# Altium project EB2_Cyclone_BGA324 1_03.PrjPCB
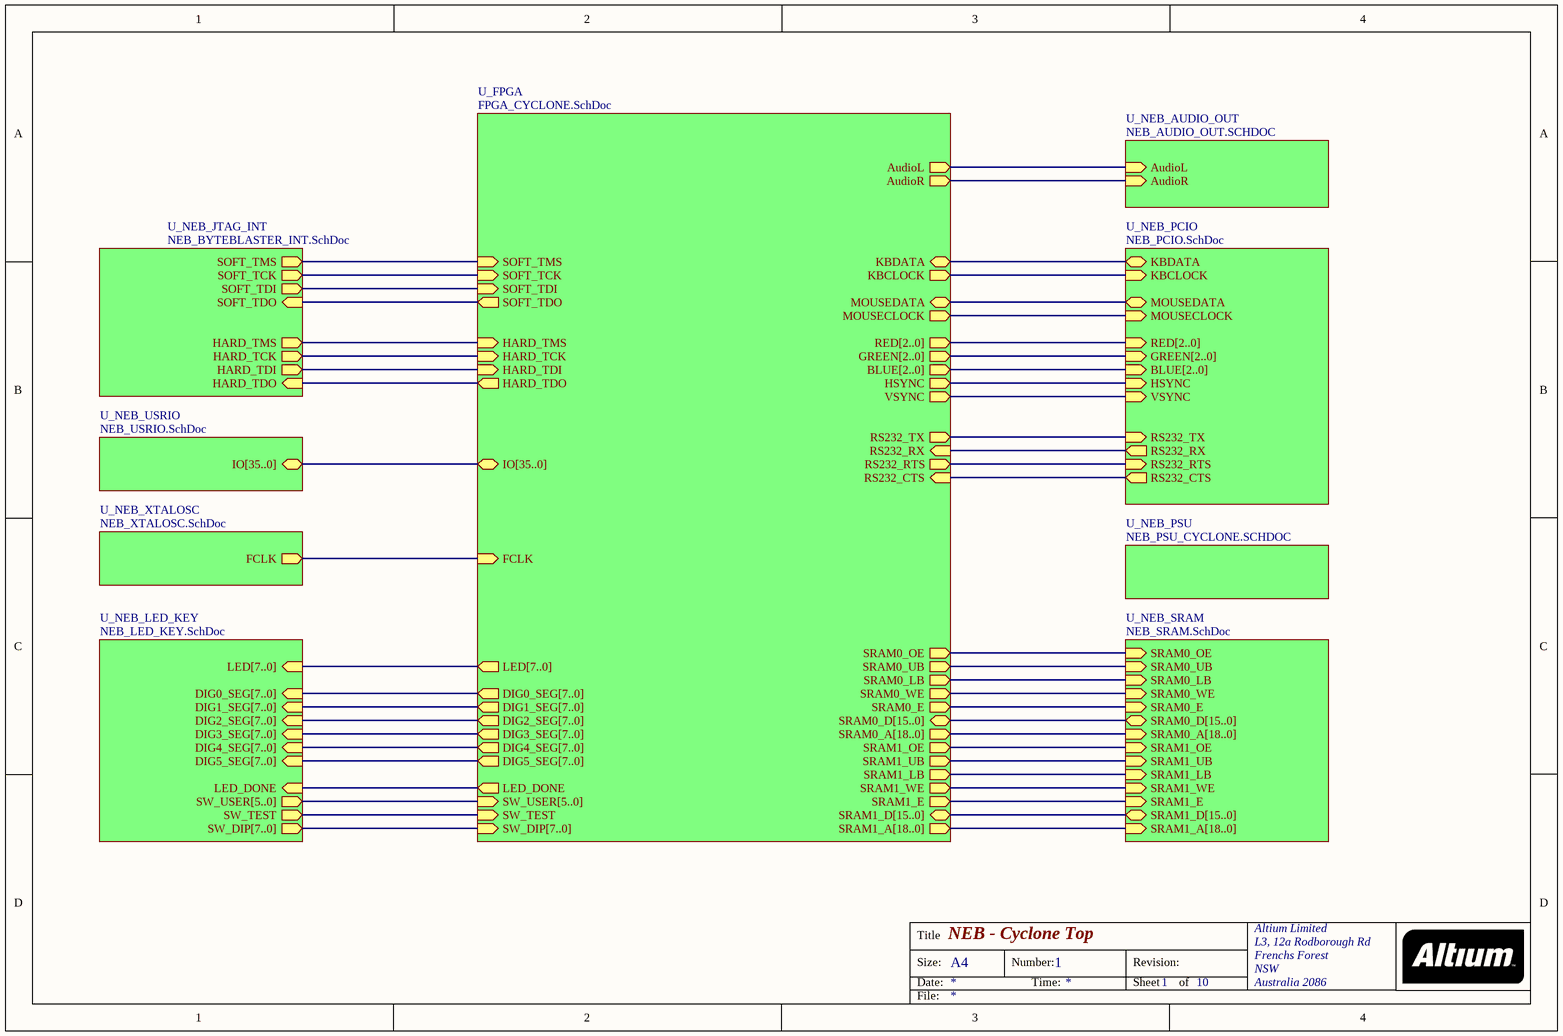
[diagram p0: NEB_TOP_CYCLONE.SchDoc]
5 sheets, 174 parts. Net scope: hierarchical (ports join the sheet entries above them; power ports are global).
Board file: EB2_Cyclone_1_03.PcbDoc
Sheets:
  NEB_TOP_CYCLONE.SchDoc
    U_NEB_JTAG_INT = NEB_BYTEBLASTER_INT.SchDoc
    U_NEB_LED_KEY = NEB_LED_KEY.SchDoc
    U_NEB_USRIO = NEB_USRIO.SchDoc
    U_NEB_PCIO = NEB_PCIO.SchDoc

## Sheet NEB_TOP_CYCLONE.SchDoc: NEB - Cyclone Top
size A4; Organization: Altium Limited; Address1: L3, 12a Rodborough Rd; Address2: Frenchs Forest; Address3: NSW; Address4: Australia 2086; DocumentNumber: 1; SheetNumber: 1; SheetTotal: 10

### Sub-sheets
U_FPGA = FPGA_CYCLONE.SchDoc (file not in this document): SOFT_TMS (in), SOFT_TCK (in), SOFT_TDI (in), SOFT_TDO (out), HARD_TMS (in), HARD_TCK (in), HARD_TDI (in), HARD_TDO (out), IO[35..0] (bidir), FCLK (in), LED[7..0] (out), DIG1_SEG[7..0] (out), DIG0_SEG[7..0] (out), DIG2_SEG[7..0] (out), DIG3_SEG[7..0] (out), LED_DONE (out), SW_USER[5..0] (in), SRAM1_E (out), SRAM1_WE (out), SRAM1_LB (out), SRAM1_UB (out), SRAM1_OE (out), SRAM0_E (out), SRAM0_WE (out), SRAM0_LB (out), SRAM0_UB (out), SRAM0_OE (out), SRAM0_A[18..0] (out), SRAM1_A[18..0] (out), RS232_RTS (out), RS232_TX (out), VSYNC (out), HSYNC (out), BLUE[2..0] (out), GREEN[2..0] (out), RED[2..0] (out), MOUSECLOCK (out), KBCLOCK (out), AudioR (out), AudioL (out), SW_TEST (in), SW_DIP[7..0] (in), RS232_RX (in), RS232_CTS (in), KBDATA (bidir), MOUSEDATA (bidir), SRAM0_D[15..0] (bidir), SRAM1_D[15..0] (bidir), DIG4_SEG[7..0] (out), DIG5_SEG[7..0] (out)
U_NEB_AUDIO_OUT = NEB_AUDIO_OUT.SCHDOC (file not in this document): AudioL (in), AudioR (in)
U_NEB_JTAG_INT = NEB_BYTEBLASTER_INT.SchDoc: SOFT_TCK (out), SOFT_TDI (out), SOFT_TMS (out), SOFT_TDO (in), HARD_TMS (out), HARD_TCK (out), HARD_TDI (out), HARD_TDO (in)
U_NEB_LED_KEY = NEB_LED_KEY.SchDoc: LED[7..0] (in), SW_DIP[7..0] (out), DIG0_SEG[7..0] (in), DIG1_SEG[7..0] (in), DIG2_SEG[7..0] (in), DIG3_SEG[7..0] (in), SW_TEST (out), SW_USER[5..0] (out), LED_DONE (in), DIG4_SEG[7..0] (in), DIG5_SEG[7..0] (in)
U_NEB_PCIO = NEB_PCIO.SchDoc: RS232_RTS (in), RS232_TX (in), RS232_CTS (out), RS232_RX (out), KBDATA (bidir), KBCLOCK (in), MOUSEDATA (bidir), MOUSECLOCK (in), RED[2..0] (in), GREEN[2..0] (in), HSYNC (in), VSYNC (in), BLUE[2..0] (in)
U_NEB_PSU = NEB_PSU_CYCLONE.SCHDOC (file not in this document): no entries
U_NEB_SRAM = NEB_SRAM.SchDoc (file not in this document): SRAM0_OE (in), SRAM0_UB (in), SRAM0_LB (in), SRAM0_WE (in), SRAM0_E (in), SRAM0_D[15..0] (bidir), SRAM0_A[18..0] (in), SRAM1_OE (in), SRAM1_UB (in), SRAM1_LB (in), SRAM1_WE (in), SRAM1_E (in), SRAM1_D[15..0] (bidir), SRAM1_A[18..0] (in)
U_NEB_USRIO = NEB_USRIO.SchDoc: IO[35..0] (bidir)
U_NEB_XTALOSC = NEB_XTALOSC.SchDoc (file not in this document): FCLK (out)

### Nets
HARD_TCK: sheet U_NEB_JTAG_INT/HARD_TCK, sheet U_FPGA/HARD_TCK
HARD_TDI: sheet U_NEB_JTAG_INT/HARD_TDI, sheet U_FPGA/HARD_TDI
HARD_TDO: sheet U_NEB_JTAG_INT/HARD_TDO, sheet U_FPGA/HARD_TDO
HARD_TMS: sheet U_NEB_JTAG_INT/HARD_TMS, sheet U_FPGA/HARD_TMS
SOFT_TCK: sheet U_NEB_JTAG_INT/SOFT_TCK, sheet U_FPGA/SOFT_TCK
SOFT_TDI: sheet U_NEB_JTAG_INT/SOFT_TDI, sheet U_FPGA/SOFT_TDI
SOFT_TDO: sheet U_NEB_JTAG_INT/SOFT_TDO, sheet U_FPGA/SOFT_TDO
SOFT_TMS: sheet U_NEB_JTAG_INT/SOFT_TMS, sheet U_FPGA/SOFT_TMS
SW_TEST: sheet U_NEB_LED_KEY/SW_TEST, sheet U_FPGA/SW_TEST
NetLED4_2: sheet U_NEB_PCIO/RS232_TX, sheet U_FPGA/RS232_TX
NetLED5_2: sheet U_NEB_PCIO/RS232_RTS, sheet U_FPGA/RS232_RTS
NetR24_1: sheet U_NEB_LED_KEY/LED_DONE, sheet U_FPGA/LED_DONE
NetR88_1: sheet U_NEB_PCIO/KBDATA, sheet U_FPGA/KBDATA
NetR89_1: sheet U_NEB_PCIO/KBCLOCK, sheet U_FPGA/KBCLOCK
NetR90_1: sheet U_NEB_PCIO/RS232_RX, sheet U_FPGA/RS232_RX
NetR91_1: sheet U_NEB_PCIO/RS232_CTS, sheet U_FPGA/RS232_CTS
NetR92_1: sheet U_NEB_PCIO/MOUSEDATA, sheet U_FPGA/MOUSEDATA
NetR93_1: sheet U_NEB_PCIO/MOUSECLOCK, sheet U_FPGA/MOUSECLOCK
NetR94_1: sheet U_NEB_PCIO/HSYNC, sheet U_FPGA/HSYNC
NetR95_1: sheet U_NEB_PCIO/VSYNC, sheet U_FPGA/VSYNC
(unnamed): sheet U_NEB_AUDIO_OUT/AudioL, sheet U_FPGA/AudioL
(unnamed): sheet U_NEB_AUDIO_OUT/AudioR, sheet U_FPGA/AudioR
(unnamed): sheet U_NEB_SRAM/SRAM0_OE, sheet U_FPGA/SRAM0_OE
(unnamed): sheet U_NEB_SRAM/SRAM0_UB, sheet U_FPGA/SRAM0_UB
(unnamed): sheet U_NEB_SRAM/SRAM0_LB, sheet U_FPGA/SRAM0_LB
(unnamed): sheet U_NEB_SRAM/SRAM0_WE, sheet U_FPGA/SRAM0_WE
(unnamed): sheet U_NEB_SRAM/SRAM0_E, sheet U_FPGA/SRAM0_E
(unnamed): sheet U_NEB_SRAM/SRAM1_OE, sheet U_FPGA/SRAM1_OE
(unnamed): sheet U_NEB_SRAM/SRAM1_UB, sheet U_FPGA/SRAM1_UB
(unnamed): sheet U_NEB_SRAM/SRAM1_LB, sheet U_FPGA/SRAM1_LB
(unnamed): sheet U_NEB_SRAM/SRAM1_WE, sheet U_FPGA/SRAM1_WE
(unnamed): sheet U_NEB_SRAM/SRAM1_E, sheet U_FPGA/SRAM1_E
(unnamed): sheet U_NEB_XTALOSC/FCLK, sheet U_FPGA/FCLK

### Buses and harness runs
bus sheet U_FPGA/BLUE[2..0] = sheet U_NEB_PCIO/BLUE[2..0]
bus sheet U_FPGA/DIG0_SEG[7..0] = sheet U_NEB_LED_KEY/DIG0_SEG[7..0]
bus sheet U_FPGA/DIG1_SEG[7..0] = sheet U_NEB_LED_KEY/DIG1_SEG[7..0]
bus sheet U_FPGA/DIG2_SEG[7..0] = sheet U_NEB_LED_KEY/DIG2_SEG[7..0]
bus sheet U_FPGA/DIG3_SEG[7..0] = sheet U_NEB_LED_KEY/DIG3_SEG[7..0]
bus sheet U_FPGA/DIG4_SEG[7..0] = sheet U_NEB_LED_KEY/DIG4_SEG[7..0]
bus sheet U_FPGA/DIG5_SEG[7..0] = sheet U_NEB_LED_KEY/DIG5_SEG[7..0]
bus sheet U_FPGA/GREEN[2..0] = sheet U_NEB_PCIO/GREEN[2..0]
bus sheet U_FPGA/IO[35..0] = sheet U_NEB_USRIO/IO[35..0]
bus sheet U_FPGA/LED[7..0] = sheet U_NEB_LED_KEY/LED[7..0]
bus sheet U_FPGA/RED[2..0] = sheet U_NEB_PCIO/RED[2..0]
bus sheet U_FPGA/SRAM0_A[18..0] = sheet U_NEB_SRAM/SRAM0_A[18..0]
bus sheet U_FPGA/SRAM0_D[15..0] = sheet U_NEB_SRAM/SRAM0_D[15..0]
bus sheet U_FPGA/SRAM1_A[18..0] = sheet U_NEB_SRAM/SRAM1_A[18..0]
bus sheet U_FPGA/SRAM1_D[15..0] = sheet U_NEB_SRAM/SRAM1_D[15..0]
bus sheet U_FPGA/SW_DIP[7..0] = sheet U_NEB_LED_KEY/SW_DIP[7..0]
bus sheet U_FPGA/SW_USER[5..0] = sheet U_NEB_LED_KEY/SW_USER[5..0]

### Notes on the sheet
- Title
- Size:
- Date:
- A4
- Number:
- Time:
- Revision:
- Sheet
- of
- File:

## Sheet NEB_BYTEBLASTER_INT.SchDoc: ByteBlaster Parallel Port Interface
size A4; CompanyName: Altium; DrawnBy: Ch.W.; Organization: Altium Limited; Address1: L3, 12a Rodborough Rd; Address2: Frenchs Forest; Address3: NSW; Address4: Australia 2086; DocumentNumber: 5; Revision: V0.9; SheetNumber: 5; SheetTotal: 10
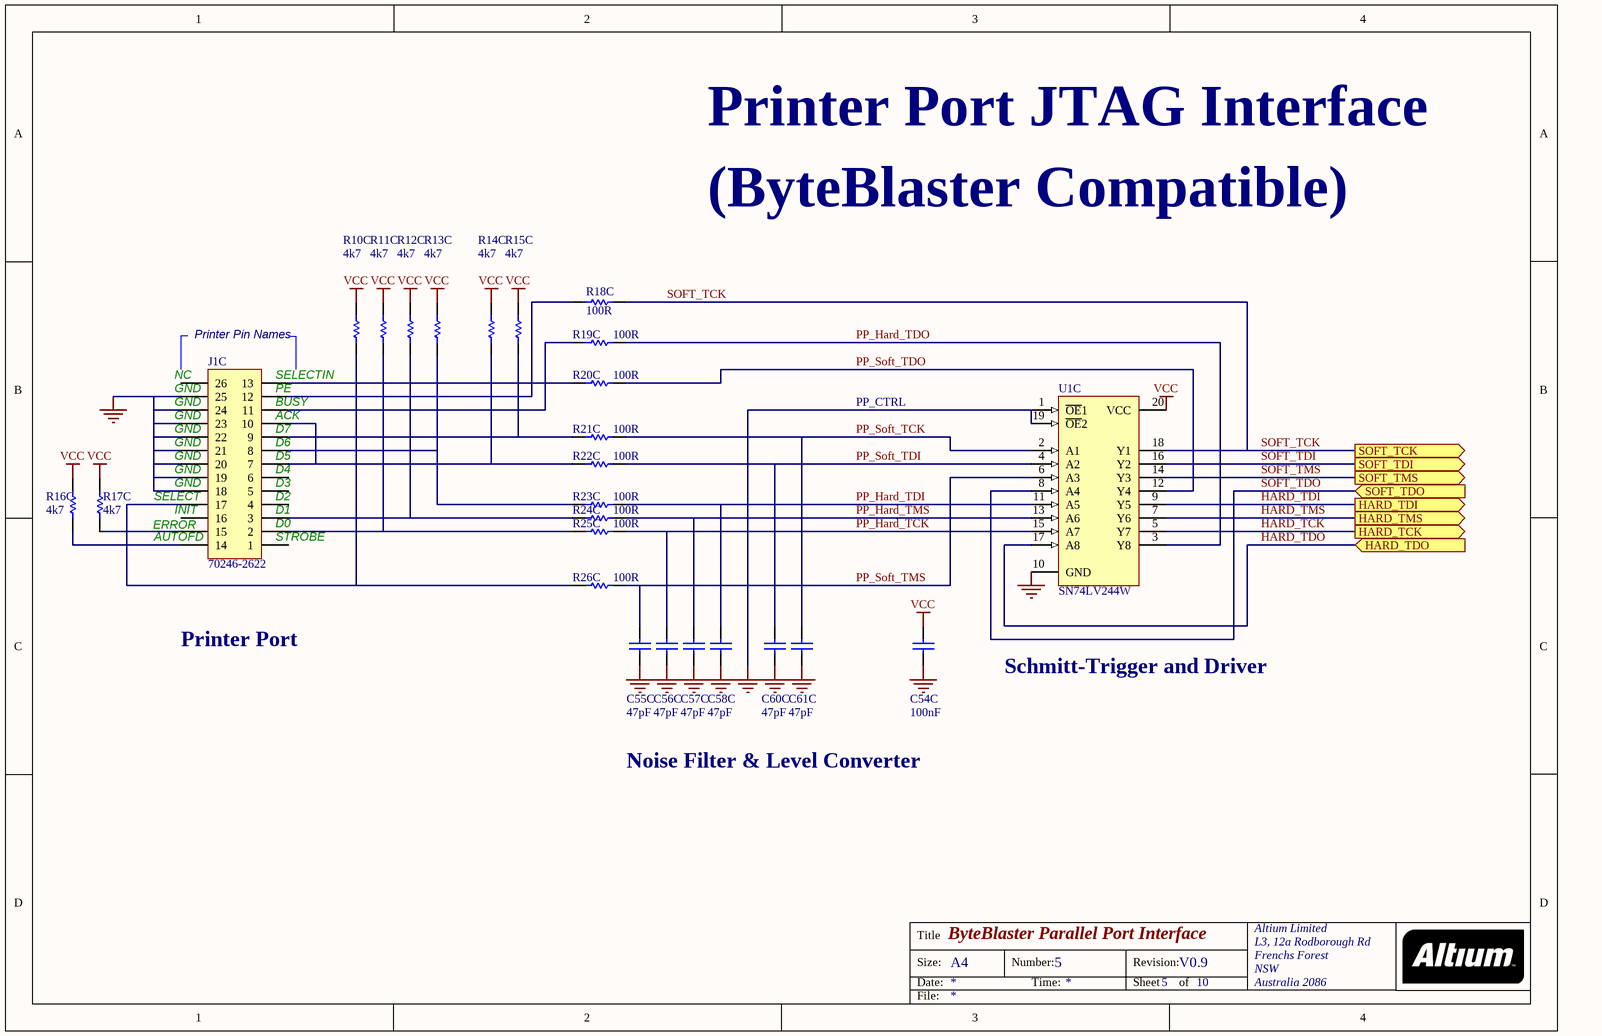
[diagram p1: NEB_BYTEBLASTER_INT.SchDoc]

### Parts
C54C  100nF  [CC2012-0805]
C55C  47pF  [CC2012-0805]
C56C  47pF  [CC2012-0805]
C57C  47pF  [CC2012-0805]
C58C  47pF  [CC2012-0805]
C60C  47pF  [CC2012-0805]
C61C  47pF  [CC2012-0805]
J1C  70246-2622  [HDR2X13_CEN_LP]
R10C  4k7  [CC2012-0805]
R11C  4k7  [CR2012-0805]
R12C  4k7  [CR2012-0805]
R13C  4k7  [CR2012-0805]
R14C  4k7  [CR2012-0805]
R15C  4k7  [CR2012-0805]
R16C  4k7  [CR2012-0805]
R17C  4k7  [CR2012-0805]
R18C  100R  [CC2012-0805]
R19C  100R  [CR2012-0805]
R20C  100R  [CR2012-0805]
R21C  100R  [CR2012-0805]
R22C  100R  [CR2012-0805]
R23C  100R  [CR2012-0805]
R24C  100R  [CR2012-0805]
R25C  100R  [CR2012-0805]
R26C  100R  [CR2012-0805]
U1C  SN74LV244W  [SSO-G20/P.65]

### Ports
HARD_TCK (out), HARD_TDI (out), HARD_TDO (in), HARD_TMS (out), SOFT_TCK (out), SOFT_TDI (out), SOFT_TDO (in), SOFT_TMS (out)

### Nets
GND: C54C.2 C55C.2 C56C.2 C57C.2 C58C.2 C60C.2 C61C.2 J1C.18 J1C.19 J1C.20 J1C.21 J1C.22 J1C.23 J1C.24 J1C.25 U1C.1(~{OE}1) U1C.10(GND) U1C.19(~{OE}2)
VCC: C54C.1 R10C.1 R11C.1 R12C.1 R13C.1 R14C.1 R15C.1 R16C.1 R17C.1 U1C.20(VCC)
HARD_TCK: U1C.5(Y7) ; port HARD_TCK
HARD_TDI: U1C.9(Y5) ; port HARD_TDI
HARD_TDO: U1C.17(A8) ; port HARD_TDO
HARD_TMS: U1C.7(Y6) ; port HARD_TMS
PP_Hard_TCK: C56C.1 R25C.1 U1C.15(A7)
PP_Hard_TDI: C58C.1 R23C.1 U1C.11(A5)
PP_Hard_TDO: R19C.1 U1C.3(Y8)
PP_Hard_TMS: C57C.1 R24C.1 U1C.13(A6)
PP_Soft_TCK: C61C.1 R21C.1 U1C.2(A1)
PP_Soft_TDI: C60C.1 R22C.1 U1C.4(A2)
PP_Soft_TDO: R20C.1 U1C.12(Y4)
PP_Soft_TMS: C55C.1 R26C.1 U1C.6(A3)
SOFT_TCK: R18C.2 U1C.18(Y1) ; port SOFT_TCK
SOFT_TDI: U1C.16(Y2) ; port SOFT_TDI
SOFT_TDO: U1C.8(A4) ; port SOFT_TDO
SOFT_TMS: U1C.14(Y3) ; port SOFT_TMS
NetJ1C_2: J1C.2 R11C.2 R25C.2
NetJ1C_3: J1C.3 R12C.2 R24C.2
NetJ1C_7: J1C.7 J1C.10 R14C.2 R22C.2
NetJ1C_8: J1C.8 R13C.2 R23C.2
NetJ1C_9: J1C.9 R15C.2 R21C.2
NetJ1C_11: J1C.11 R19C.2
NetJ1C_12: J1C.12 R18C.1
NetJ1C_13: J1C.13 R20C.2
NetJ1C_14: J1C.14 R16C.2
NetJ1C_15: J1C.15 R17C.2
NetJ1C_17: J1C.17 R10C.2 R26C.2

Not connected (* = marked no-connect by the designer): J1C 1 4 5 6 16 26

### Notes on the sheet
- Printer Port JTAG Interface
- (ByteBlaster Compatible)
- (near J1C) NC
- Printer Pin Names
- (near J1C) SELECTIN
- (near J1C) GND
- (near J1C) PE
- (near J1C) BUSY
- (near J1C) ACK
- (near J1C) D6
- (near J1C) D7
- PP_CTRL
- (near J1C) SELECT
- (near J1C) INIT
- (near J1C) D1
- (near J1C) D2
- (near J1C) D3
- (near J1C) D4
- (near J1C) D5
- (near J1C) ERROR
- (near J1C) AUTOFD
- (near J1C) STROBE
- (near J1C) D0
- Printer Port
- Schmitt-Trigger and Driver
- Noise Filter & Level Converter
- Title
- Size:
- Date:
- A4
- Number:
- Time:
- Revision:
- Sheet
- of
- File:

### Library data of the parts
C54C C55C C56C C57C C58C C60C C61C = CAP: Capacitor; Fitted: True; Supplier: FARNELL; Supplier Code: 755-552
J1C = Header 13X2A: Header, 13-Pin, Dual row; Manufacturer: Generic Components; Class I: Connector; Fitted: True; Revision: July-2002: Re-released for DXP Platform.; Publisher: Altium Limited
R10C R11C R12C R13C R14C R15C R16C R17C R19C R20C R21C R22C R23C R24C R25C R26C = RES: Resistor; Fitted: True
R18C = RES: Resistor
U1C = SN54LV244W: Octal Buffer/Driver with 3-State Outputs; Package Information: Latest Revision: Jan-1995; Published: 8-Jun-2000; Revision: 17-Jul-2002: Re-released for DXP Platform.; Datasheet: Latest Revision: Apr-1996; Package Reference: W020; Publisher: Altium Limited

## Sheet NEB_LED_KEY.SchDoc
size A4; Organization: Altium Limited; Address1: L3, 12a Rodborough Rd; Address2: Frenchs Forest; Address3: NSW; Address4: Australia 2086; DocumentNumber: 3; SheetNumber: 3; SheetTotal: 10
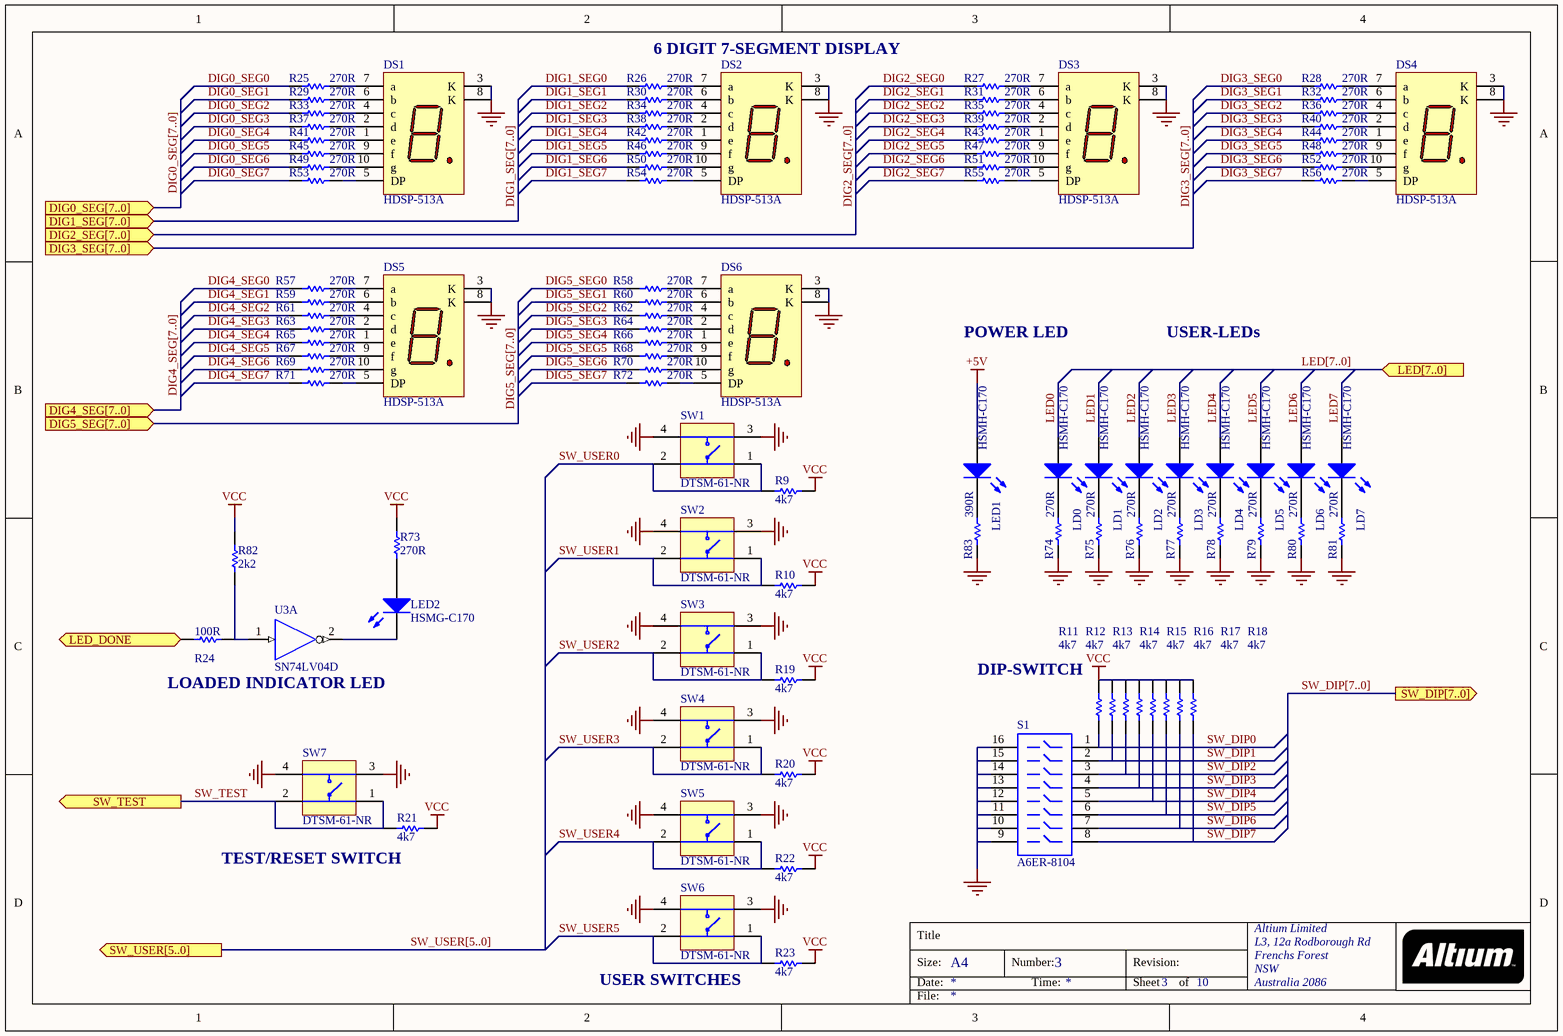
[diagram p2: NEB_LED_KEY.SchDoc]

### Parts
DS1  HDSP-513A  [SA/SC56]
DS2  HDSP-513A  [SA/SC56]
DS3  HDSP-513A  [SA/SC56]
DS4  HDSP-513A  [SA/SC56]
DS5  HDSP-513A  [SA/SC56]
DS6  HDSP-513A  [SA/SC56]
LD0  HSMH-C170  [SMD _LED]
LD1  HSMH-C170  [SMD _LED]
LD2  HSMH-C170  [SMD _LED]
LD3  HSMH-C170  [SMD _LED]
LD4  HSMH-C170  [SMD _LED]
LD5  HSMH-C170  [SMD _LED]
LD6  HSMH-C170  [SMD _LED]
LD7  HSMH-C170  [SMD _LED]
LED1  HSMH-C170  [SMD _LED]
LED2  HSMG-C170  [SMD _LED]
R9  4k7  [CR2012-0805]
R10  4k7  [CR2012-0805]
R11  4k7  [CR2012-0805]
R12  4k7  [CR2012-0805]
R13  4k7  [CR2012-0805]
R14  4k7  [CR2012-0805]
R15  4k7  [CR2012-0805]
R16  4k7  [CR2012-0805]
R17  4k7  [CR2012-0805]
R18  4k7  [CR2012-0805]
R19  4k7  [CR2012-0805]
R20  4k7  [CR2012-0805]
R21  4k7  [CR2012-0805]
R22  4k7  [CR2012-0805]
R23  4k7  [CR2012-0805]
R24  100R  [CR2012-0805]
R25  270R  [CR2012-0805]
R26  270R  [CR2012-0805]
R27  270R  [CR2012-0805]
R28  270R  [CR2012-0805]
R29  270R  [CR2012-0805]
R30  270R  [CR2012-0805]
R31  270R  [CR2012-0805]
R32  270R  [CR2012-0805]
R33  270R  [CR2012-0805]
R34  270R  [CR2012-0805]
R35  270R  [CR2012-0805]
R36  270R  [CR2012-0805]
R37  270R  [CR2012-0805]
R38  270R  [CR2012-0805]
R39  270R  [CR2012-0805]
R40  270R  [CR2012-0805]
R41  270R  [CR2012-0805]
R42  270R  [CR2012-0805]
R43  270R  [CR2012-0805]
R44  270R  [CR2012-0805]
R45  270R  [CR2012-0805]
R46  270R  [CR2012-0805]
R47  270R  [CR2012-0805]
R48  270R  [CR2012-0805]
R49  270R  [CR2012-0805]
R50  270R  [CR2012-0805]
R51  270R  [CR2012-0805]
R52  270R  [CR2012-0805]
R53  270R  [CR2012-0805]
R54  270R  [CR2012-0805]
R55  270R  [CR2012-0805]
R56  270R  [CR2012-0805]
R57  270R  [CR2012-0805]
R58  270R  [CR2012-0805]
R59  270R  [CR2012-0805]
R60  270R  [CR2012-0805]
R61  270R  [CR2012-0805]
R62  270R  [CR2012-0805]
R63  270R  [CR2012-0805]
R64  270R  [CR2012-0805]
R65  270R  [CR2012-0805]
R66  270R  [CR2012-0805]
R67  270R  [CR2012-0805]
R68  270R  [CR2012-0805]
R69  270R  [CR2012-0805]
R70  270R  [CR2012-0805]
R71  270R  [CR2012-0805]
R72  270R  [CR2012-0805]
R73  270R  [CR2012-0805]
R74  270R  [CR2012-0805]
R75  270R  [CR2012-0805]
R76  270R  [CR2012-0805]
R77  270R  [CR2012-0805]
R78  270R  [CR2012-0805]
R79  270R  [CR2012-0805]
R80  270R  [CR2012-0805]
R81  270R  [CR2012-0805]
R82  2k2  [CR2012-0805]
R83  390R  [CR2012-0805]
S1  A6ER-8104  [DIP-16-KEY]
SW1  DTSM-61-NR  [B3FS_SWITCH]
SW2  DTSM-61-NR  [B3FS_SWITCH]
SW3  DTSM-61-NR  [B3FS_SWITCH]
SW4  DTSM-61-NR  [B3FS_SWITCH]
SW5  DTSM-61-NR  [B3FS_SWITCH]
SW6  DTSM-61-NR  [B3FS_SWITCH]
SW7  DTSM-61-NR  [B3FS_SWITCH]
U3  SN74LV04D  [D014]  (part A of 6)

### Ports
DIG0_SEG[7..0] (in), DIG1_SEG[7..0] (in), DIG2_SEG[7..0] (in), DIG3_SEG[7..0] (in), DIG4_SEG[7..0] (in), DIG5_SEG[7..0] (in), LED[7..0] (in), LED_DONE (in), SW_DIP[7..0] (out), SW_TEST (out), SW_USER[5..0] (out)

### Nets
+5V: LED1.1(A)
GND: DS1.3(K) DS1.8(K) DS2.3(K) DS2.8(K) DS3.3(K) DS3.8(K) DS4.3(K) DS4.8(K) DS5.3(K) DS5.8(K) DS6.3(K) DS6.8(K) R74.1 R75.1 R76.1 R77.1 R78.1 R79.1 R80.1 R81.1 R83.1 S1.9 S1.10 S1.11 S1.12 S1.13 S1.14 S1.15 S1.16 SW1.3 SW1.4 SW2.3 SW2.4 SW3.3 SW3.4 SW4.3 SW4.4 SW5.3 SW5.4 SW6.3 SW6.4 SW7.3 SW7.4 U3.7(GND)
VCC: R9.1 R10.1 R11.2 R12.2 R13.2 R14.2 R15.2 R16.2 R17.2 R18.2 R19.1 R20.1 R21.1 R22.1 R23.1 R73.2 R82.1 U3.14(VCC)
DIG0_SEG0: R25.2
DIG0_SEG1: R29.2
DIG0_SEG2: R33.2
DIG0_SEG3: R37.2
DIG0_SEG4: R41.2
DIG0_SEG5: R45.2
DIG0_SEG6: R49.2
DIG0_SEG7: R53.2
DIG1_SEG0: R26.2
DIG1_SEG1: R30.2
DIG1_SEG2: R34.2
DIG1_SEG3: R38.2
DIG1_SEG4: R42.2
DIG1_SEG5: R46.2
DIG1_SEG6: R50.2
DIG1_SEG7: R54.2
DIG2_SEG0: R27.2
DIG2_SEG1: R31.2
DIG2_SEG2: R35.2
DIG2_SEG3: R39.2
DIG2_SEG4: R43.2
DIG2_SEG5: R47.2
DIG2_SEG6: R51.2
DIG2_SEG7: R55.2
DIG3_SEG0: R28.2
DIG3_SEG1: R32.2
DIG3_SEG2: R36.2
DIG3_SEG3: R40.2
DIG3_SEG4: R44.2
DIG3_SEG5: R48.2
DIG3_SEG6: R52.2
DIG3_SEG7: R56.2
DIG4_SEG0: R57.2
DIG4_SEG1: R59.2
DIG4_SEG2: R61.2
DIG4_SEG3: R63.2
DIG4_SEG4: R65.2
DIG4_SEG5: R67.2
DIG4_SEG6: R69.2
DIG4_SEG7: R71.2
DIG5_SEG0: R58.2
DIG5_SEG1: R60.2
DIG5_SEG2: R62.2
DIG5_SEG3: R64.2
DIG5_SEG4: R66.2
DIG5_SEG5: R68.2
DIG5_SEG6: R70.2
DIG5_SEG7: R72.2
LED0: LD0.1(A)
LED1: LD1.1(A)
LED2: LD2.1(A)
LED3: LD3.1(A)
LED4: LD4.1(A)
LED5: LD5.1(A)
LED6: LD6.1(A)
LED7: LD7.1(A)
SW_DIP0: R11.1 S1.1
SW_DIP1: R12.1 S1.2
SW_DIP2: R13.1 S1.3
SW_DIP3: R14.1 S1.4
SW_DIP4: R15.1 S1.5
SW_DIP5: R16.1 S1.6
SW_DIP6: R17.1 S1.7
SW_DIP7: R18.1 S1.8
SW_TEST: R21.2 SW7.1 SW7.2 ; port SW_TEST
SW_USER0: R9.2 SW1.1 SW1.2
SW_USER1: R10.2 SW2.1 SW2.2
SW_USER2: R19.2 SW3.1 SW3.2
SW_USER3: R20.2 SW4.1 SW4.2
SW_USER4: R22.2 SW5.1 SW5.2
SW_USER5: R23.2 SW6.1 SW6.2
NetDS1_1: DS1.1(e) R41.1
NetDS1_2: DS1.2(d) R37.1
NetDS1_4: DS1.4(c) R33.1
NetDS1_5: DS1.5(DP) R53.1
NetDS1_6: DS1.6(b) R29.1
NetDS1_7: DS1.7(a) R25.1
NetDS1_9: DS1.9(f) R45.1
NetDS1_10: DS1.10(g) R49.1
NetDS2_1: DS2.1(e) R42.1
NetDS2_2: DS2.2(d) R38.1
NetDS2_4: DS2.4(c) R34.1
NetDS2_5: DS2.5(DP) R54.1
NetDS2_6: DS2.6(b) R30.1
NetDS2_7: DS2.7(a) R26.1
NetDS2_9: DS2.9(f) R46.1
NetDS2_10: DS2.10(g) R50.1
NetDS3_1: DS3.1(e) R43.1
NetDS3_2: DS3.2(d) R39.1
NetDS3_4: DS3.4(c) R35.1
NetDS3_5: DS3.5(DP) R55.1
NetDS3_6: DS3.6(b) R31.1
NetDS3_7: DS3.7(a) R27.1
NetDS3_9: DS3.9(f) R47.1
NetDS3_10: DS3.10(g) R51.1
NetDS4_1: DS4.1(e) R44.1
NetDS4_2: DS4.2(d) R40.1
NetDS4_4: DS4.4(c) R36.1
NetDS4_5: DS4.5(DP) R56.1
NetDS4_6: DS4.6(b) R32.1
NetDS4_7: DS4.7(a) R28.1
NetDS4_9: DS4.9(f) R48.1
NetDS4_10: DS4.10(g) R52.1
NetDS5_1: DS5.1(e) R65.1
NetDS5_2: DS5.2(d) R63.1
NetDS5_4: DS5.4(c) R61.1
NetDS5_5: DS5.5(DP) R71.1
NetDS5_6: DS5.6(b) R59.1
NetDS5_7: DS5.7(a) R57.1
NetDS5_9: DS5.9(f) R67.1
NetDS5_10: DS5.10(g) R69.1
NetDS6_1: DS6.1(e) R66.1
NetDS6_2: DS6.2(d) R64.1
NetDS6_4: DS6.4(c) R62.1
NetDS6_5: DS6.5(DP) R72.1
NetDS6_6: DS6.6(b) R60.1
NetDS6_7: DS6.7(a) R58.1
NetDS6_9: DS6.9(f) R68.1
NetDS6_10: DS6.10(g) R70.1
NetLD0_2: LD0.2(K) R74.2
NetLD1_2: LD1.2(K) R75.2
NetLD2_2: LD2.2(K) R76.2
NetLD3_2: LD3.2(K) R77.2
NetLD4_2: LD4.2(K) R78.2
NetLD5_2: LD5.2(K) R79.2
NetLD6_2: LD6.2(K) R80.2
NetLD7_2: LD7.2(K) R81.2
NetLED1_2: LED1.2(K) R83.2
NetLED2_1: LED2.1(A) R73.1
NetLED2_2: LED2.2(K) U3.2(Y)
NetR24_1: R24.1 ; port LED_DONE
NetR24_2: R24.2 R82.2 U3.1(A)

### Buses and harness runs
bus DIG0_SEG[7..0] = port DIG0_SEG[7..0]
bus DIG1_SEG[7..0] = port DIG1_SEG[7..0]
bus DIG2_SEG[7..0] = port DIG2_SEG[7..0]
bus DIG3_SEG[7..0] = port DIG3_SEG[7..0]
bus DIG4_SEG[7..0] = port DIG4_SEG[7..0]
bus DIG5_SEG[7..0] = port DIG5_SEG[7..0]
bus LED[7..0] = port LED[7..0]
bus SW_DIP[7..0] = port SW_DIP[7..0]
bus SW_USER[5..0] = port SW_USER[5..0]

### Notes on the sheet
- 6 DIGIT 7-SEGMENT DISPLAY
- POWER LED
- USER-LEDs
- LOADED INDICATOR LED
- DIP-SWITCH
- TEST/RESET SWITCH
- (near SW6) USER SWITCHES
- Title
- Size:
- Date:
- A4
- Number:
- Time:
- Revision:
- Sheet
- of
- File:

### Library data of the parts
DS1-DS6 = HDSP-513A: 14.2 mm General Purpose 7-Segment Display: CC, RH DP; Package Information: Latest Revision: 25-Jul-2001; Min. Intensity: 3201 ucd; Note: IF = 10 mA; Colour: AlGaAs Red; Published: 26-May-2004; Datasheet: Latest Revision: 25-Jul-2001; Package Reference: HDSP-5; Publisher: Altium Limited
LD0-LD7 LED1 = HSMX-C670: Typical RED GaAs SMD LED Agilent make; Manufacturer: Generic Components; Class I: Optoelectronic; Fitted: True; Published: 8-Jun-2000; Revision: July-2002: Re-released for DXP Platform.; Publisher: Altium Limited; Class II: LED
LED2 = HSMX-C670: Typical GREEN GaAs SMD LED Agilent make; Manufacturer: Generic Components; Class I: Optoelectronic; Fitted: True; Published: 8-Jun-2000; Revision: July-2002: Re-released for DXP Platform.; Publisher: Altium Limited; Class II: LED
R9-R23 R25-R72 R74-R81 R83 = RES: Resistor; Fitted: True
R24 R73 R82 = RES: Resistor
S1 = A6ER-8104: DIP Switch Side actuator long liver Piano Key; Manufacturer: Generic Components; Fitted: True; Published: 24-Mar-1999; Revision: July-2002: Re-released for DXP Platform.; Publisher: Altium Limited
SW1-SW7 = B3FS: SPNA SMD Keyboard Switch; Fitted: True
U3 = SN74LV04D: Hex Inverter; Package Information: Latest Revision: Jan-1998; Published: 8-Jun-2000; Revision: 17-Jul-2002: Re-released for DXP Platform.; Datasheet: Latest Revision: Apr-1996; Package Reference: D014; Publisher: Altium Limited

## Sheet NEB_USRIO.SchDoc
size A4; Organization: Altium Limited; Address1: L3, 12a Rodborough Rd; Address2: Frenchs Forest; Address3: NSW; Address4: Australia 2086; DocumentNumber: 6; SheetNumber: 6; SheetTotal: 10
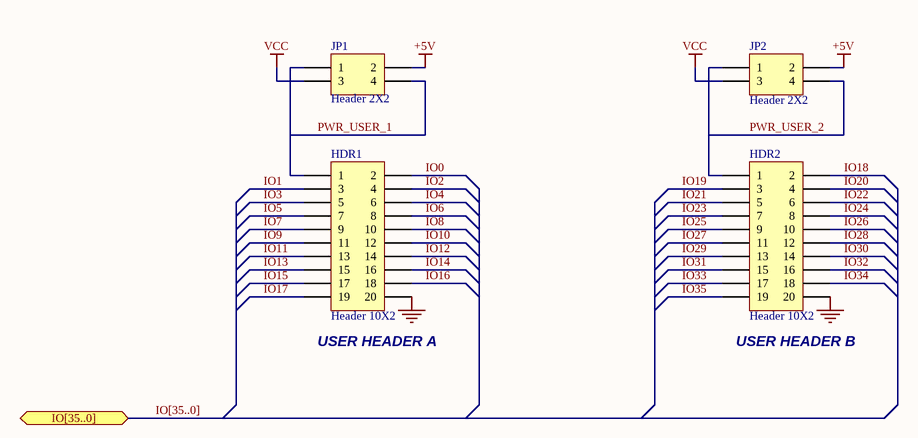
[diagram p3: NEB_USRIO.SchDoc]

### Parts
HDR1  Header 10X2  [HDR2X10]
HDR2  Header 10X2  [HDR2X10]
JP1  Header 2X2  [HDR2X2_B]
JP2  Header 2X2  [HDR2X2_B]

### Ports
IO[35..0] (bidir)

### Nets
+5V: JP1.2 JP2.2
GND: HDR1.20 HDR2.20
VCC: JP1.3 JP2.3
IO0: HDR1.2
IO1: HDR1.3
IO2: HDR1.4
IO3: HDR1.5
IO4: HDR1.6
IO5: HDR1.7
IO6: HDR1.8
IO7: HDR1.9
IO8: HDR1.10
IO9: HDR1.11
IO10: HDR1.12
IO11: HDR1.13
IO12: HDR1.14
IO13: HDR1.15
IO14: HDR1.16
IO15: HDR1.17
IO16: HDR1.18
IO17: HDR1.19
IO18: HDR2.2
IO19: HDR2.3
IO20: HDR2.4
IO21: HDR2.5
IO22: HDR2.6
IO23: HDR2.7
IO24: HDR2.8
IO25: HDR2.9
IO26: HDR2.10
IO27: HDR2.11
IO28: HDR2.12
IO29: HDR2.13
IO30: HDR2.14
IO31: HDR2.15
IO32: HDR2.16
IO33: HDR2.17
IO34: HDR2.18
IO35: HDR2.19
PWR_USER_1: HDR1.1 JP1.1 JP1.4
PWR_USER_2: HDR2.1 JP2.1 JP2.4

### Buses and harness runs
bus IO[35..0] = port IO[35..0]

### Notes on the sheet
- (near HDR1) USER HEADER A
- (near HDR2) USER HEADER B
- Title
- Size:
- Date:
- A4
- Number:
- Time:
- Revision:
- Sheet
- of
- File:

### Library data of the parts
HDR1 HDR2 = Header 10X2: Header, 10-Pin, Dual row; Manufacturer: Generic Components; Class I: Connector; Fitted: True; Revision: July-2002: Re-released for DXP Platform.; Publisher: Altium Limited
JP1 JP2 = Header 2X2: Header, 2-Pin, Dual row; Manufacturer: Generic Components; Class I: Connector; Fitted: True; Revision: July-2002: Re-released for DXP Platform.; Publisher: Altium Limited

## Sheet NEB_PCIO.SchDoc
size A4; Organization: Altium Limited; Address1: L3, 12a Rodborough Rd; Address2: Frenchs Forest; Address3: NSW; Address4: Australia 2086; DocumentNumber: 9; SheetNumber: 9; SheetTotal: 10
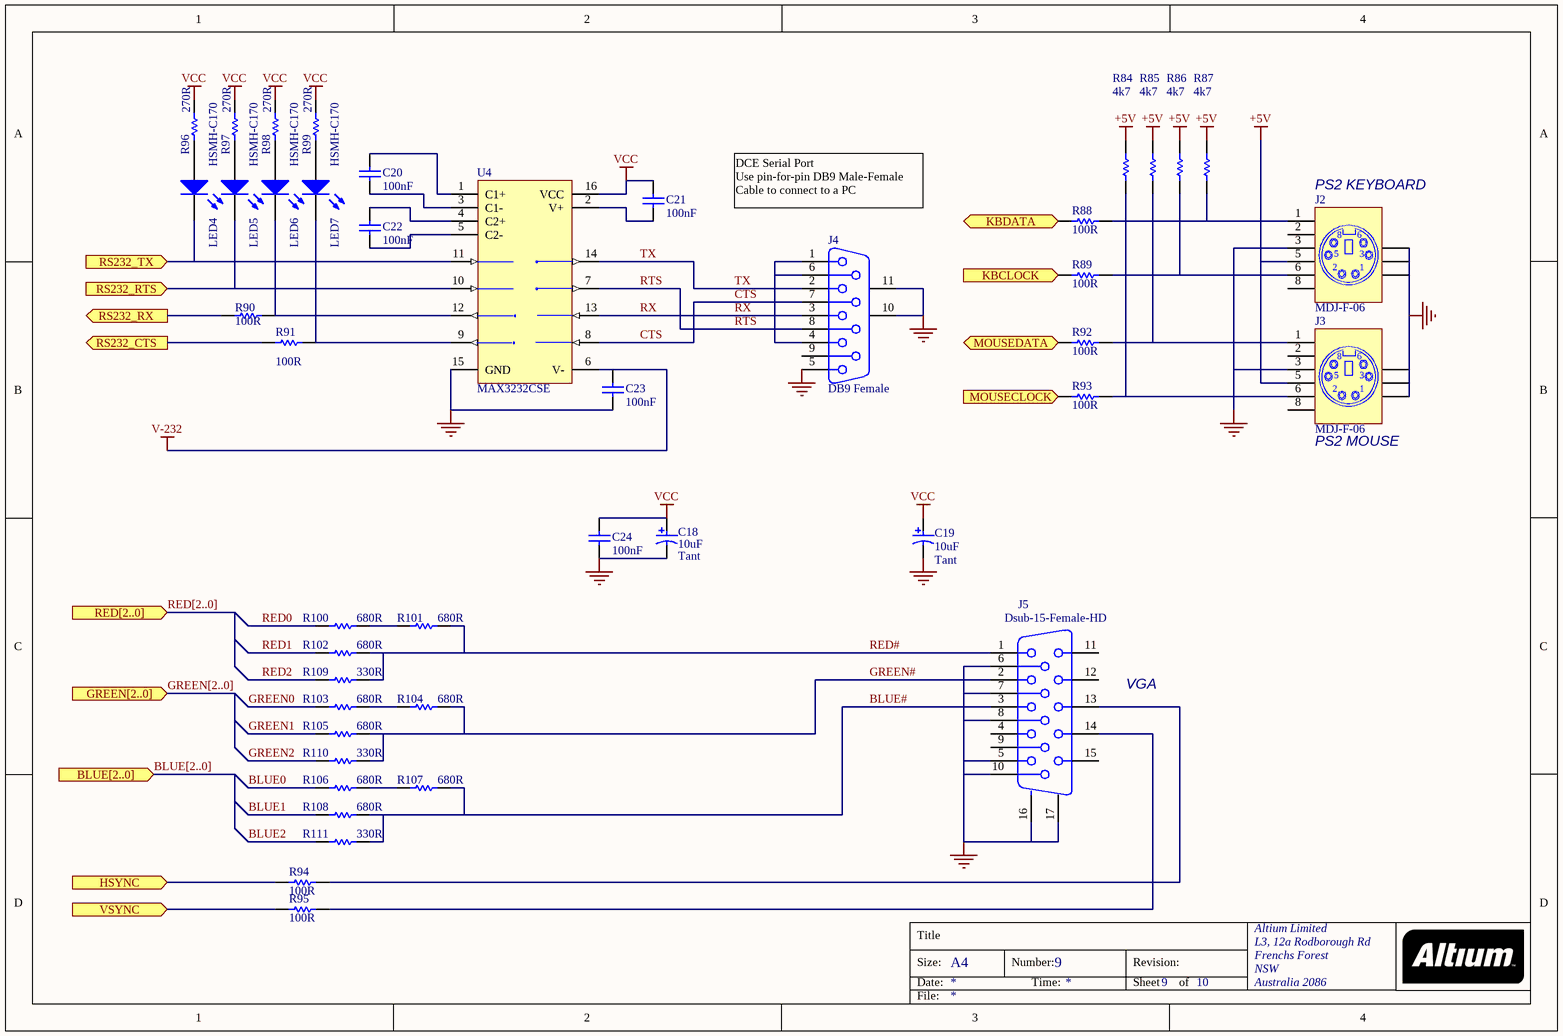
[diagram p4: NEB_PCIO.SchDoc]

### Parts
C18  10uF  Capacitor Type: Tant  [MCCT-B]
C19  10uF  Capacitor Type: Tant  [MCCT-B]
C20  100nF  [CC2012-0805]
C21  100nF  [CC2012-0805]
C22  100nF  [CC2012-0805]
C23  100nF  [CC2012-0805]
C24  100nF  [CC2012-0805]
J2  MDJ-F-06  [MDJ-F-06]
J3  MDJ-F-06  [MDJ-F-06]
J4  DB9 Female  [DSUB1.385-2H9]
J5  Dsub-15-Female-HD  [DB15-VGA-Female]
LED4  HSMH-C170  [SMD _LED]
LED5  HSMH-C170  [SMD _LED]
LED6  HSMH-C170  [SMD _LED]
LED7  HSMH-C170  [SMD _LED]
R84  4k7  [CR2012-0805]
R85  4k7  [CR2012-0805]
R86  4k7  [CR2012-0805]
R87  4k7  [CR2012-0805]
R88  100R  [CR2012-0805]
R89  100R  [CR2012-0805]
R90  100R  [CR2012-0805]
R91  100R  [CR2012-0805]
R92  100R  [CR2012-0805]
R93  100R  [CR2012-0805]
R94  100R  [CR2012-0805]
R95  100R  [CR2012-0805]
R96  270R  [CR2012-0805]
R97  270R  [CR2012-0805]
R98  270R  [CR2012-0805]
R99  270R  [CR2012-0805]
R100  680R  [CR2012-0805]
R101  680R  [CR2012-0805]
R102  680R  [CR2012-0805]
R103  680R  [CR2012-0805]
R104  680R  [CR2012-0805]
R105  680R  [CR2012-0805]
R106  680R  [CR2012-0805]
R107  680R  [CR2012-0805]
R108  680R  [CR2012-0805]
R109  330R  [CR2012-0805]
R110  330R  [CR2012-0805]
R111  330R  [CR2012-0805]
U4  MAX3232CSE  [TSSO5x6-G16]

### Ports
BLUE[2..0] (in), GREEN[2..0] (in), HSYNC (in), KBCLOCK (in), KBDATA (bidir), MOUSECLOCK (in), MOUSEDATA (bidir), RED[2..0] (in), RS232_CTS (out), RS232_RTS (in), RS232_RX (out), RS232_TX (in), VSYNC (in)

### Nets
+5V: J2.5 J3.5 R84.1 R85.1 R86.1 R87.1
GND: C18.2 C19.2 C23.2 C24.2 J2.3 J2.MH1 J2.MH2 J2.MH3 J3.3 J3.MH1 J3.MH2 J3.MH3 J4.5 J4.10(MH1) J4.11(MH2) J5.5 J5.6 J5.7 J5.8 J5.10 J5.16(MH1) J5.17(MH2) U4.15(GND)
V-232: C23.1 U4.6(V-)
VCC: C18.1 C19.1 C21.1 C24.1 R96.2 R97.2 R98.2 R99.2 U4.16(VCC)
BLUE0: R106.1
BLUE1: R108.1
BLUE2: R111.1
BLUE#: J5.3 R107.2 R108.2 R111.2
CTS: J4.7 U4.8(R2IN)
GREEN0: R103.1
GREEN1: R105.1
GREEN2: R110.1
GREEN#: J5.2 R104.2 R105.2 R110.2
RED0: R100.1
RED1: R102.1
RED2: R109.1
RED#: J5.1 R101.2 R102.2 R109.2
RTS: J4.8 U4.7(T2OUT)
RX: J4.3 U4.13(R1IN)
TX: J4.2 U4.14(T1OUT)
NetC20_1: C20.1 U4.1(C1+)
NetC20_2: C20.2 U4.3(C1-)
NetC21_2: C21.2 U4.2(V+)
NetC22_1: C22.1 U4.4(C2+)
NetC22_2: C22.2 U4.5(C2-)
NetJ2_1: J2.1 R87.2 R88.2
NetJ2_6: J2.6 R86.2 R89.2
NetJ3_1: J3.1 R85.2 R92.2
NetJ3_6: J3.6 R84.2 R93.2
NetJ4_1: J4.1 J4.4 J4.6
NetJ5_13: J5.13 R94.2
NetJ5_14: J5.14 R95.2
NetLED4_1: LED4.1(A) R96.1
NetLED4_2: LED4.2(K) U4.11(T1IN) ; port RS232_TX
NetLED5_1: LED5.1(A) R97.1
NetLED5_2: LED5.2(K) U4.10(T2IN) ; port RS232_RTS
NetLED6_1: LED6.1(A) R98.1
NetLED6_2: LED6.2(K) R90.2 U4.12(R1OUT)
NetLED7_1: LED7.1(A) R99.1
NetLED7_2: LED7.2(K) R91.2 U4.9(R2OUT)
NetR88_1: R88.1 ; port KBDATA
NetR89_1: R89.1 ; port KBCLOCK
NetR90_1: R90.1 ; port RS232_RX
NetR91_1: R91.1 ; port RS232_CTS
NetR92_1: R92.1 ; port MOUSEDATA
NetR93_1: R93.1 ; port MOUSECLOCK
NetR94_1: R94.1 ; port HSYNC
NetR95_1: R95.1 ; port VSYNC
NetR100_2: R100.2 R101.1
NetR103_2: R103.2 R104.1
NetR106_2: R106.2 R107.1

Not connected (* = marked no-connect by the designer): J2 2 8; J3 2 8; J4 9; J5 4 9 11 12 15

### Buses and harness runs
bus BLUE[2..0] = port BLUE[2..0]
bus GREEN[2..0] = port GREEN[2..0]
bus RED[2..0] = port RED[2..0]

### Notes on the sheet
- DCE Serial Port
  Use pin-for-pin DB9 Male-Female
  Cable to connect to a PC
- (near J2) PS2 KEYBOARD
- (near J3) PS2 MOUSE
- VGA
- Title
- Size:
- Date:
- A4
- Number:
- Time:
- Revision:
- Sheet
- of
- File:

### Library data of the parts
C18 C19 = CAP_POLAR: Polar Capacitor; Fitted: True; Supplier: FARNELL; Supplier Code: 967-117
C20-C24 = CAP: Capacitor; Fitted: True; Supplier: FARNELL; Supplier Code: 755-552
J2 J3 = MDJ-F-06: Circular DIN, 6 Postion, Jack, Pitch 2.1/2.6 mm; PCB Layout: Complies with manufacturer's recommendation.; Drill Size: Corresponds to nominal value.; Published: 26-Aug-2004; Package Reference: MDJ-F-06; Publisher: Altium Limited
J4 = D Connector 9: Receptacle Assembly, 9 Position, Right Angle; Manufacturer: Generic Components; Package Information: Latest Revision: O; Positions: 9; Fitted: True; Published: 15-Jun-2001; Revision: July-2002: Re-released for DXP Platform.; Datasheet: (1-Sep-1999); Package Reference: 788750; Publisher: Altium Limited; Class I: Connector; Orientation: Right Angle; Gender: Receptacle
J5 = Dsub-15-Female-HD: Dsub-15 High density VGA Female connetor; Manufacturer: Generic Components; Package Information: Latest Revision: E; Class I: Connector; Positions: 30; Gender: Receptacle Header; Fitted: True; Published: 15-Jun-2001; Revision: July-2002: Re-released for DXP Platform.; Datasheet: (31-Oct-1991); Package Reference: 174213; Publisher: Altium Limited; Orientation: Right Angle
LED4-LED7 = HSMX-C670: as LD0 on sheet NEB_LED_KEY; Published: 8-Jun-2000; Revision: July-2002: Re-released for DXP Platform.; Publisher: Altium Limited; Class II: LED
R84-R111 = RES: Resistor; Fitted: True
U4 = MAX3232EUE: 3.0V TO 5.5V, Low-Power, up to 1Mbps, True RS-232 Transceiver Using Four 0.1µF External Capacitor; Manufacturer: Maxim,ST; Package Information: Latest Revision: 21-0066 C; Class I: Communication; Published: 16-Jan-2001; Revision: July-2002: Re-released for DXP Platform.; Datasheet: Latest Revision: Mar-1999; Package Reference: TSSOP16; Publisher: Altium Limited; Class II: Transceiver; Fitted: True

## Nets that join several sheets
+5V: NEB_LED_KEY (LED1.1), NEB_USRIO (JP1.2 JP2.2), NEB_PCIO (6 pins)
GND: NEB_BYTEBLASTER_INT (18 pins), NEB_LED_KEY (44 pins), NEB_USRIO (HDR1.20 HDR2.20), NEB_PCIO (23 pins)
VCC: NEB_BYTEBLASTER_INT (10 pins), NEB_LED_KEY (18 pins), NEB_USRIO (JP1.3 JP2.3), NEB_PCIO (9 pins)